# Altium schematic sheet 海关全向本体电路板V3_2路电池接入.SchDoc
size A4
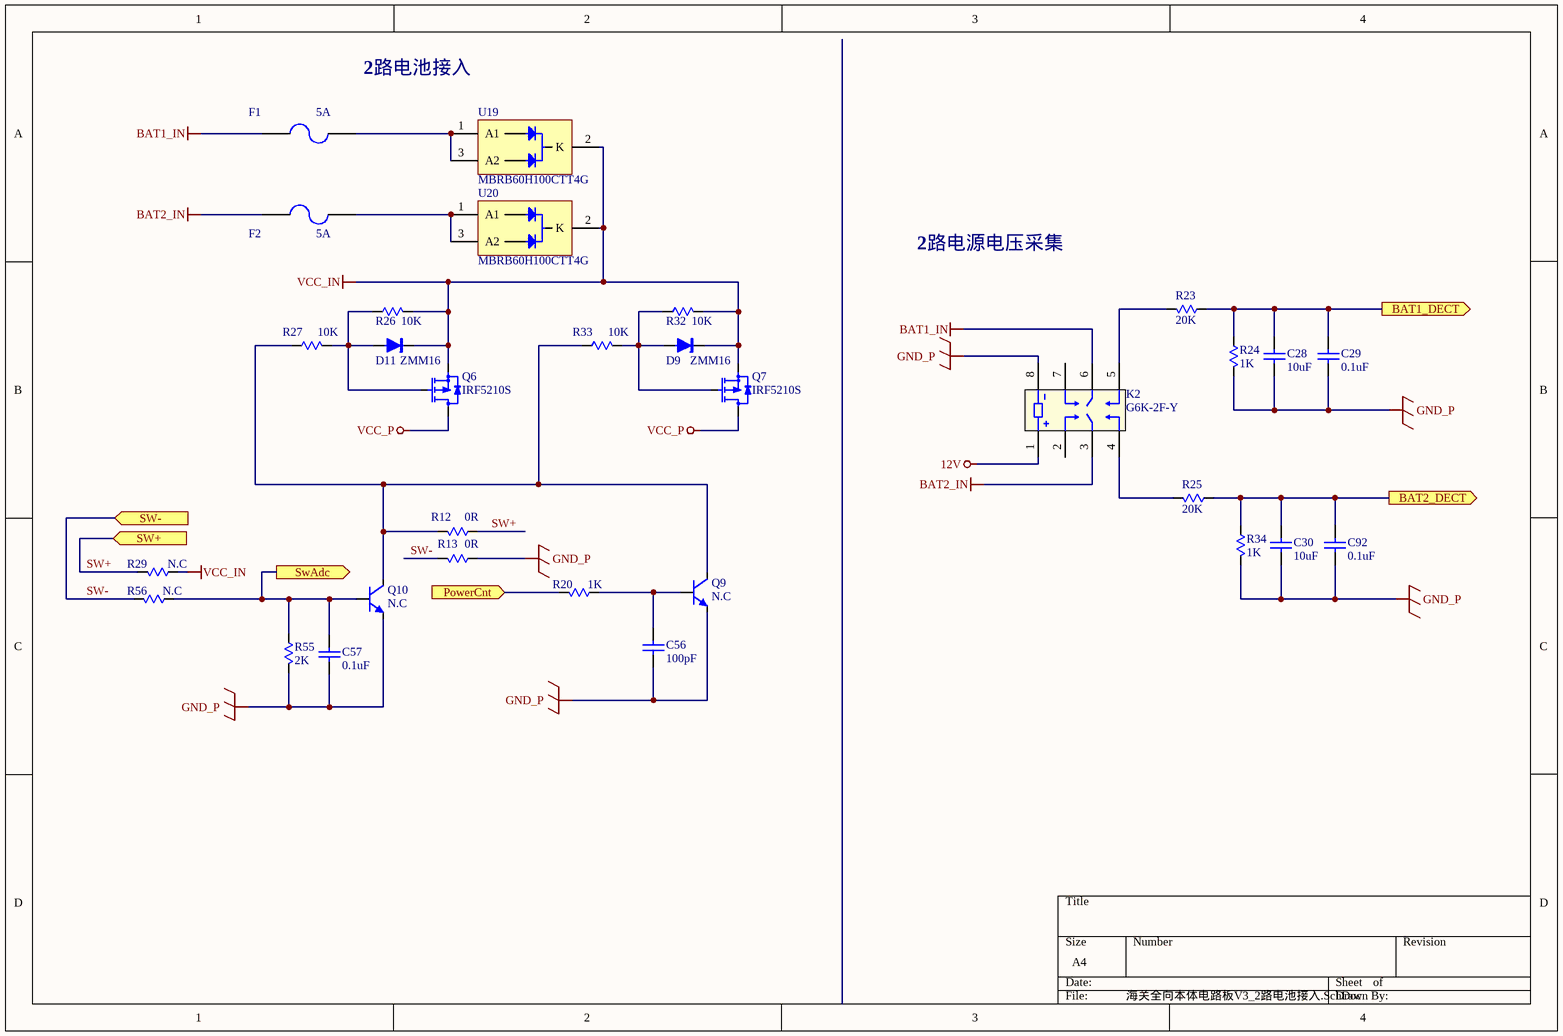
[diagram p0: 海关全向本体电路板V3_2路电池接入.SchDoc]

## Parts
C28  10uF  [C0603-S]
C29  0.1uF  [C0603-S]
C30  10uF  [C0603-S]
C56  100pF  [C0603-S]
C57  0.1uF  [C0603-S]
C92  0.1uF  [C0603-S]
D9  ZMM16  [SOD-80-S]
D11  ZMM16  [SOD-80-S]
F1  5A  [AXIAL0.5]
F2  5A  [AXIAL0.5]
K2  G6K-2F-Y  [G6K-2F-Y]
Q6  IRF5210S  [TO-263]
Q7  IRF5210S  [TO-263]
Q9  N.C  [SOT-23]
Q10  N.C  [SOT-23]
R12  0R  [R1206-S]
R13  0R  [R1206-S]
R20  1K  [R0805-S]
R23  20K  [R0805-S]
R24  1K  [R0805-S]
R25  20K  [R0805-S]
R26  10K  [R0805-S]
R27  10K  [R0805-S]
R29  N.C  [R0805-S]
R32  10K  [R0805-S]
R33  10K  [R0805-S]
R34  1K  [R0805-S]
R55  2K  [R0805-S]
R56  N.C  [R0805-S]
U19  MBRB60H100CTT4G  [TO-263-S]
U20  MBRB60H100CTT4G  [TO-263-S]

## Ports
BAT1_DECT (out), BAT2_DECT (out), PowerCnt (in), SW+ (in), SW- (in), SwAdc (out)

## Nets
12V: K2.1
BAT1_IN: F1.1 K2.6
BAT2_IN: F2.1 K2.3
GND_P: C28.2 C29.2 C30.2 C56.1 C57.1 C92.2 K2.8 Q9.2(E) Q10.2(E) R13.1 R24.1 R34.1 R55.1
VCC_IN: D9.2(K) D11.2(K) Q6.3(S) Q7.3(S) R26.1 R29.2 R32.1 U19.2(K) U20.2(K)
VCC_P: Q6.2(D) Q7.2(D)
BAT1_DECT: C28.1 C29.1 R23.2 R24.2 ; port BAT1_DECT
BAT2_DECT: C30.1 C92.1 R25.2 R34.2 ; port BAT2_DECT
PowerCnt: R20.1 ; port PowerCnt
SW+: R12.1 R29.1 ; port SW+
SW-: R13.2 R56.1 ; port SW-
SwAdc: C57.2 Q10.1(B) R55.2 R56.2 ; port SwAdc
NetC56_2: C56.2 Q9.1(B) R20.2
NetD9_1: D9.1(A) Q7.1(G) R32.2 R33.1
NetD11_1: D11.1(A) Q6.1(G) R26.2 R27.1
NetF1_2: F1.2 U19.1(A1) U19.3(A2)
NetF2_2: F2.2 U20.1(A1) U20.3(A2)
NetK2_4: K2.4 R25.1
NetK2_5: K2.5 R23.1
NetQ9_3: Q9.3(C) Q10.3(C) R12.2 R27.2 R33.2

Not connected (* = marked no-connect by the designer): K2 2 7

## Notes on the sheet
- 2路电池接入
- 2路电源电压采集

## Library data of the parts
C28-C30 C92 = CAP: Published: 8-Jun-2000; LatestRevisionDate: 17-Jul-2002; LatestRevisionNote: Re-released for DXP Platform.; PackageReference: RAD-0.3; Publisher: Altium Limited
  C28 C30: Value: 10uF
  C29 C92: Value: 0.1uF
C56 C57 = Cap: Capacitor; Value: 22pF; Published: 8-Jun-2000; Revision: July-2002: Re-released for DXP Platform.; Publisher: Altium Limited
D9 D11 = DIODE-ZENER: Small Signal Zener Diodes
F1 F2 = FUSE2: Fuse
Q6 Q7 = PMOS: P-Channel 30-V (D-S), 150 C MOSFET
Q9 Q10 = NPN: NPN General Purpose Amplifier; Published: 8-Jun-2000; LatestRevisionDate: 15-Jan-2003; LatestRevisionNote: PCB Footprint 'BCY-W3/D4.7' replaced; DatasheetDocument: 1997; PackageDocument: Sep-1998; PackageReference: TO-92A; Publisher: Altium Limited; Code_JEDEC: TO-92A; ComponentLink1Description: Manufacturer Link; ComponentLink1URL: http://www.fairchildsemi.com/; ComponentLink2Description: Datasheet; ComponentLink2URL: http://www.fairchildsemi.com/ds/2N%2F2N3904.pdf
R12 R13 R23-R25 R34 = RES: Resistor; Published: 8-Jun-2000; LatestRevisionDate: 17-Jul-2002; LatestRevisionNote: Re-released for DXP Platform.; PackageReference: AXIAL-0.3; Publisher: Altium Limited
  R12 R13: Value: 0R
  R23 R25: Value: 20K
  R24 R34: Value: 1K
R20 R26 R27 R29 R32 R33 R55 R56 = Res: Resistor; Published: 8-Jun-2000; LatestRevisionDate: 04-Mar-2005; LatestRevisionNote: PCB Footprint replaced.; PackageReference: J1-0603; Publisher: Altium Limited
  R20: Value: 1K
  R26 R27 R32 R33: Value: 10K
  R29 R56: Value: N.C
  R55: Value: 2K
U19 U20 = VB30200C